# Altium schematic sheet Contactors.SchDoc: HV Contactors
size A4; Engineer: Shelby Riggleman; Organization: Badgerloop; Address1: 133 Engineering Research; Address2: Building; Address3: Madison, WI 53715; Revision: 1; SheetNumber: 5
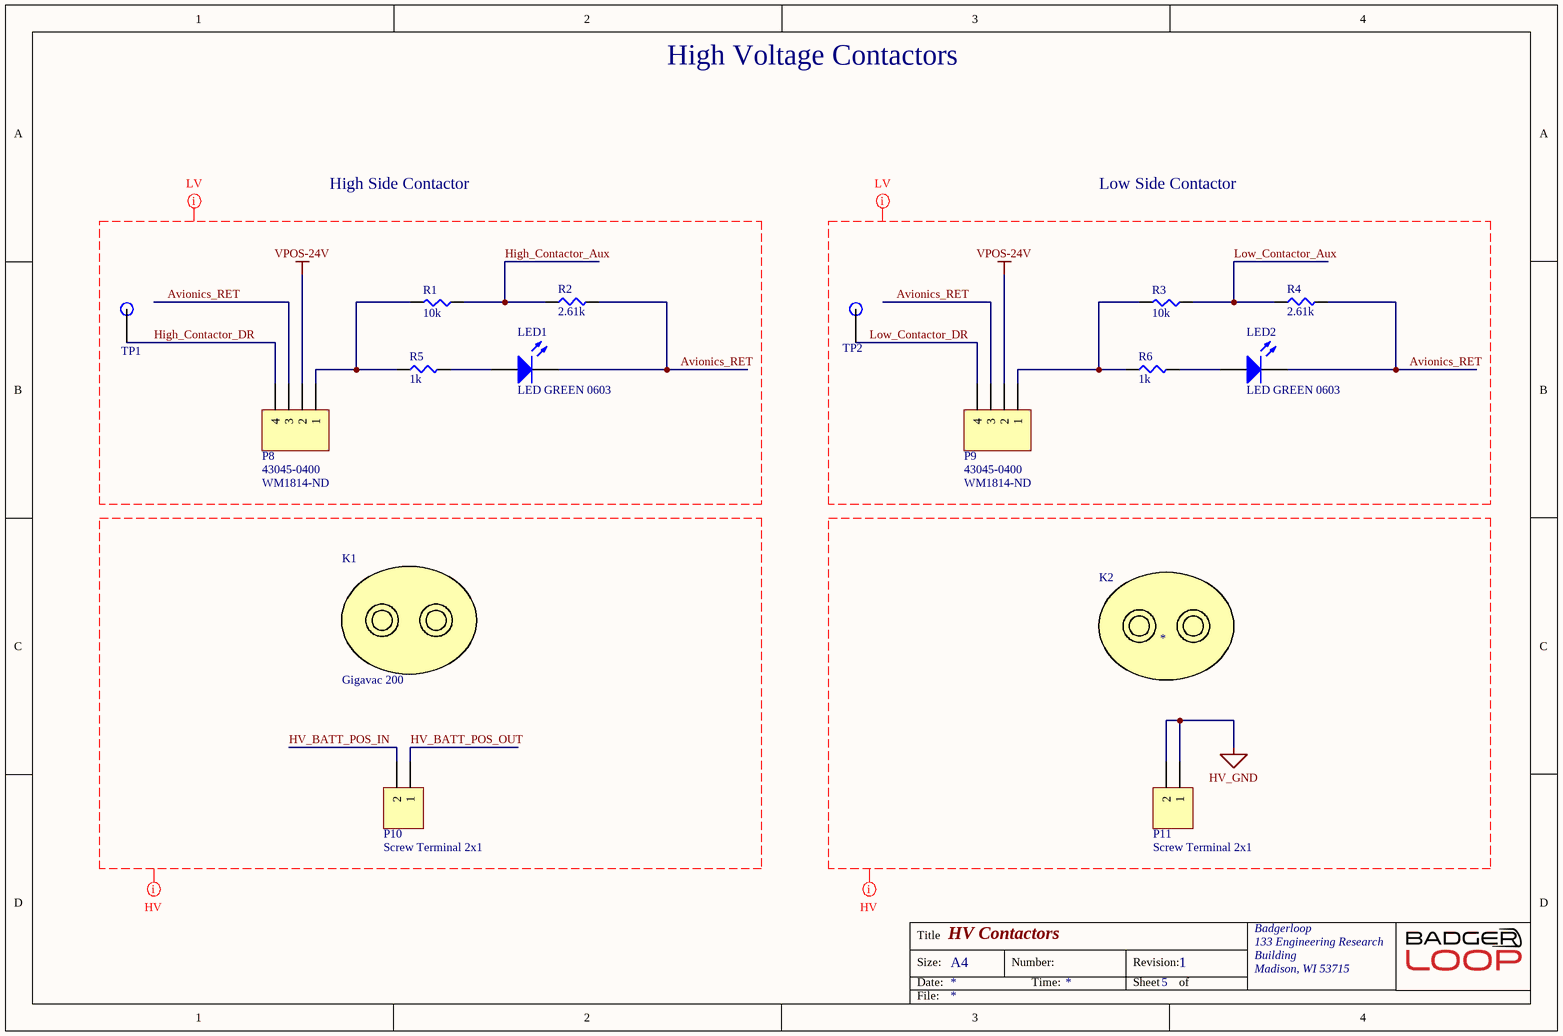
[diagram p0: Contactors.SchDoc]

## Parts
K1  Gigavac 200  [Gigavac 200]
K2  *  [Gigavac 200]
LED1  LED GREEN 0603  [LED 0603 GREEN]
LED2  LED GREEN 0603  [LED 0603 GREEN]
P8  43045-0400  Supplier Part Number 1: WM1814-ND  [430450400]
P9  43045-0400  Supplier Part Number 1: WM1814-ND  [430450400]
P10  Screw Terminal 2x1  [2POS TERM BLOCK]
P11  Screw Terminal 2x1  [2POS TERM BLOCK]
R1  10k  [SMD-0805-RES]
R2  2.61k  [SMD-1206-RES]
R3  10k  [SMD-0805-RES]
R4  2.61k  [SMD-1206-RES]
R5  1k  [SMD-0805-RES]
R6  1k  [SMD-0805-RES]
TP1  TP  [Test Point]  (value not drawn)
TP2  TP  [Test Point]  (value not drawn)

## Nets
HV_GND: P11.1 P11.2
VPOS-24V: P8.2 P9.2
Avionics_RET: LED1.2(K) LED2.2(K) P8.3 P9.3 R2.2 R4.2
High_Contactor_Aux: R1.1 R2.1
High_Contactor_DR: P8.4 TP1.1
HV_BATT_POS_IN: P10.2
HV_BATT_POS_OUT: P10.1
Low_Contactor_Aux: R3.1 R4.1
Low_Contactor_DR: P9.4 TP2.1
NetLED1_1: LED1.1(A) R5.2
NetLED2_1: LED2.1(A) R6.2
NetP8_1: P8.1 R1.2 R5.1
NetP9_1: P9.1 R3.2 R6.1

## Layout directives
net class High Voltage: HV_BATT_POS_IN, HV_BATT_POS_OUT, HV_GND
net class Low Voltage: Avionics_RET, High_Contactor_Aux, High_Contactor_DR, Low_Contactor_Aux, Low_Contactor_DR, VPOS-24V

## Notes on the sheet
- High Voltage Contactors
- High Side Contactor
- Low Side Contactor
- Title
- Size:
- Date:
- A4
- Number:
- Time:
- Revision:
- Sheet
- of
- File:

## Library data of the parts
K2 = Gigavac 200: ComponentLink1Description: http://www.gigavac.com/sites/default/files/catalog/spec_sheet/gv200.pdf; ComponentLink1URL: http://www.gigavac.com/sites/default/files/catalog/spec_sheet/gv200.pdf
LED1 LED2 = LED GREEN 0603: Manufacturer: Lite-On Inc.; Manufacturer P/N: LTST-C190KGKT; Digikey P/N: 160-1435-1-ND; Package / Case: 0603; Color: GREEN
P8 P9 = 43045-0400: Male connector dual row 90° 3 mm Pole no. 2x2 Micro-Fit, 43045-0400, Molex; Contact Resistance: 10mR; Number of Contacts: 4; Max Voltage Rating (AC): 250V; Connector Type: Male Pin; Pitch: 3mm; Row Spacing: 0.118inch; Supplier 1: Digi-Key; Manufacturer: Molex; Manufacturer Part Number: 43045-0400; Stock 1: 5904; Pricing 1: 1=1.33000, 10=1.16700, 100=1.00670, 500=0.82368, 1000=0.73216, 5000=0.64064, 10000=0.60861 (USD); RoHS: Yes; Mount: Through Hole; Contact Plating: Tin; Color: Black; Contact Material: Brass; Housing Color: Black; Housing Material: Polymer; Min Operating Temperature: -40°C; Max Operating Temperature: 105°C; Number of Rows: 2; Termination: Solder; Packaging: Tray; Fastening Type: Ramp; Number of Positions: 4; Orientation: Right Angle; Length: 10.15mm; Depth: 12.2mm; Flammability Rating: UL94 V-0; ComponentLink1URL: https://datasheet.ciiva.com/712/430450200-sd-712017.pdf?src-supplier=Digi-Key; ComponentLink1Description: https://datasheet.ciiva.com/712/430450200-sd-712017.pdf?src-supplier=Digi-Key; ComponentLink2URL: https://datasheet.ciiva.com/20209/22-3744e-20209522.pdf?src-supplier=Rapid+Electronics; ComponentLink2Description: https://datasheet.ciiva.com/20209/22-3744e-20209522.pdf?src-supplier=Rapid+Electronics; ComponentLink3URL: https://datasheet.ciiva.com/11746/0900766b80027348-11746988.pdf?src-supplier=RSComponents; ComponentLink3Description: https://datasheet.ciiva.com/11746/0900766b80027348-11746988.pdf?src-supplier=RSComponents; ComponentLink4URL: https://datasheet.ciiva.com/30193/145420430450400-pcb-headers-30193310.pdf?src-supplier=Onlinecomponents.com; ComponentLink4Description: https://datasheet.ciiva.com/30193/145420430450400-pcb-headers-30193310.pdf?src-supplier=Onlinecomponents.com
P10 P11 = Screw Terminal 2x1: Screw Terminal, 2-Pin
R1 R3 = ERJ-P06J103V: RES SMD 10K OHM 5% 1/2W 0805; Manufacturer: Panasonic Electronic Components; Factory Stock: 0; Unit Price (USD): 0.01839; @ qty: 1500; Minimum Quantity: 1; Power (Watts): 0.5W, 1/2W; Temperature Coefficient: ±200ppm/°C; Part Number: ERJ-P06J103V; Datasheets: https://industrial.panasonic.com/cdbs/www-data/pdf/RDA0000/AOA0000C243.pdf; Image: //media.digikey.com/Renders/Panasonic%20Renders/ERJ-0805%20Pkg.jpg; Digi-Key Part Number: P10KADCT-ND; Quantity Available: 413576; Packaging: Cut Tape (CT); Series: ERJ; Part Status: Active; Value: 10k; Tolerance: ±5%; Composition: Thick Film; Features: Automotive AEC-Q200, Pulse Withstanding; Operating Temperature: -55°C ~ 155°C; Package / Case: 0805 (2012 Metric); Supplier Device Package: 0805; Size / Dimension: 0.079" L x 0.049" W (2.00mm x 1.25mm); Height - Seated (Max): 0.028" (0.70mm); Number of Terminations: 2; Failure Rate: -
R2 R4 = ERJ-8ENF2611V: RES SMD 2.61K OHM 1% 1/4W 1206; Manufacturer: Panasonic Electronic Components; Factory Stock: 0; Unit Price (USD): 0.00933; @ qty: 1500; Minimum Quantity: 1; Power (Watts): 0.25W, 1/4W; Temperature Coefficient: ±100ppm/°C; Part Number: ERJ-8ENF2611V; Datasheets: http://industrial.panasonic.com/www-cgi/jvcr13pz.cgi?E+PZ+3+AOA0002+ERJ8ENF2611V+7+WW; Image: //media.digikey.com/Renders/Panasonic%20Renders/ERJ-1206%20Pkg.jpg; Digi-Key Part Number: P2.61KFCT-ND; Quantity Available: 53359; Packaging: Cut Tape (CT); Series: ERJ; Part Status: Active; Value: 2.61k; Tolerance: ±1%; Composition: Thick Film; Features: Automotive AEC-Q200; Operating Temperature: -55°C ~ 155°C; Package / Case: 1206 (3216 Metric); Supplier Device Package: 1206; Size / Dimension: 0.126" L x 0.063" W (3.20mm x 1.60mm); Height - Seated (Max): 0.028" (0.70mm); Number of Terminations: 2; Failure Rate: -
R5 R6 = ERJ-6ENF1001V: RES SMD 1K OHM 1% 1/8W 0805; Manufacturer: Panasonic Electronic Components; Factory Stock: 0; Unit Price (USD): 0.00729; @ qty: 1500; Minimum Quantity: 1; Power (Watts): 0.125W, 1/8W; Temperature Coefficient: ±100ppm/°C; Part Number: ERJ-6ENF1001V; Datasheets: http://industrial.panasonic.com/www-cgi/jvcr13pz.cgi?E+PZ+3+AOA0002+ERJ6ENF1001V+7+WW; Image: //media.digikey.com/Renders/Panasonic%20Renders/ERJ-0805%20Pkg.jpg; Digi-Key Part Number: P1.00KCCT-ND; Quantity Available: 12895103; Packaging: Cut Tape (CT); Series: ERJ; Part Status: Active; Value: 1k; Tolerance: ±1%; Composition: Thick Film; Features: Automotive AEC-Q200; Operating Temperature: -55°C ~ 155°C; Package / Case: 0805 (2012 Metric); Supplier Device Package: 0805; Size / Dimension: 0.079" L x 0.049" W (2.00mm x 1.25mm); Height - Seated (Max): 0.028" (0.70mm); Number of Terminations: 2; Failure Rate: -
TP1 TP2 = TP: SMD TEST POINT
K1 = Gigavac 200: ComponentLink1Description: http://www.gigavac.com/sites/default/files/catalog/spec_sheet/gv200.pdf; ComponentLink1URL: http://www.gigavac.com/sites/default/files/catalog/spec_sheet/gv200.pdf